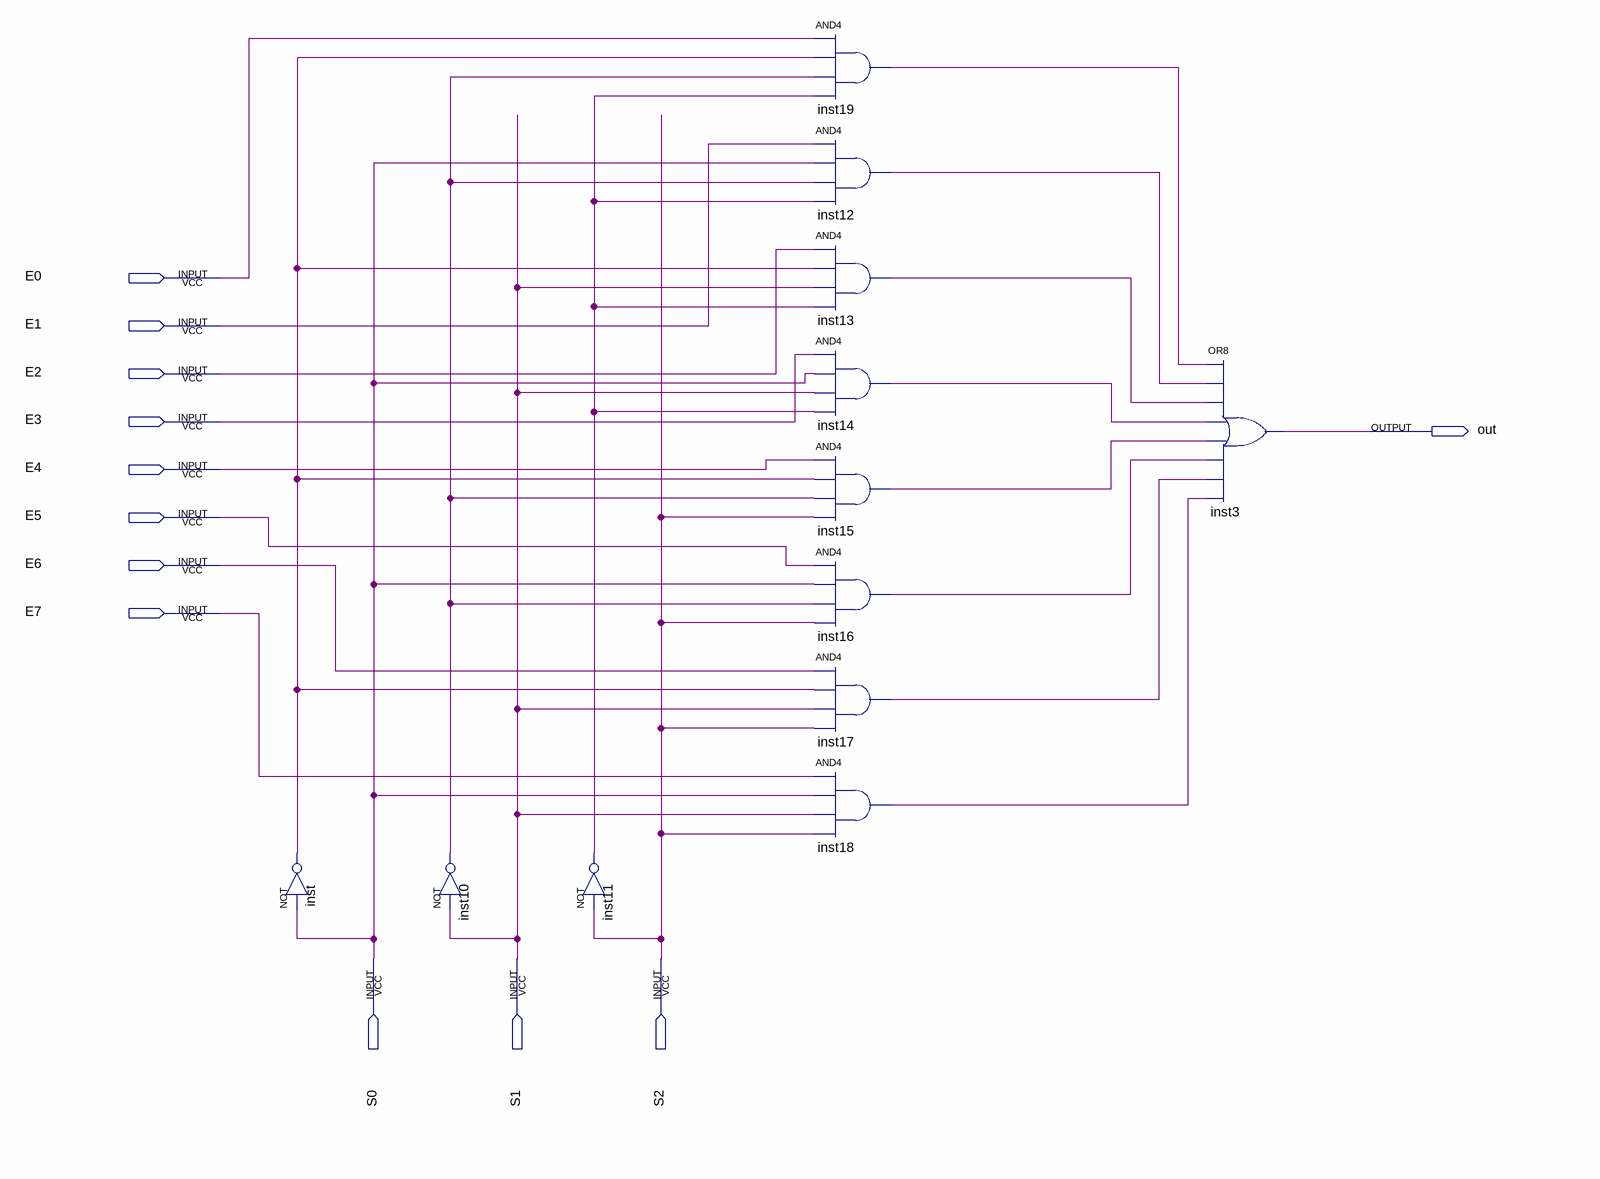
[diagram p0: schematic sheet]
// Quartus schematic MUX8x1.bdf as structural Verilog: 12 symbols, 12 pins
module MUX8x1 (
  input  E0,
  input  E1,
  input  E2,
  input  E3,
  input  E4,
  input  E5,
  input  E6,
  input  E7,
  input  S0,
  input  S1,
  input  S2,
  output out
);

  wire inst10_out, inst11_out, inst12_out, inst13_out, inst14_out, inst15_out, inst16_out, inst17_out,
       inst18_out, inst19_out, inst_out;

  not inst (inst_out, S0);
  not inst10 (inst10_out, S1);
  not inst11 (inst11_out, S2);
  and inst19 (inst19_out, E0, inst_out, inst10_out, inst11_out);
  and inst12 (inst12_out, E1, S0, inst10_out, inst11_out);
  and inst13 (inst13_out, E2, inst_out, S1, inst11_out);
  and inst14 (inst14_out, E3, S0, S1, inst11_out);
  and inst15 (inst15_out, E4, inst_out, inst10_out, S2);
  and inst16 (inst16_out, E5, S0, inst10_out, S2);
  and inst17 (inst17_out, E6, inst_out, S1, S2);
  and inst18 (inst18_out, E7, S0, S1, S2);
  or inst3 (out, inst19_out, inst12_out, inst13_out, inst14_out, inst15_out, inst16_out, inst17_out, inst18_out);
endmodule
